# Altium schematic sheet Inductance_amplification.SchDoc
size A
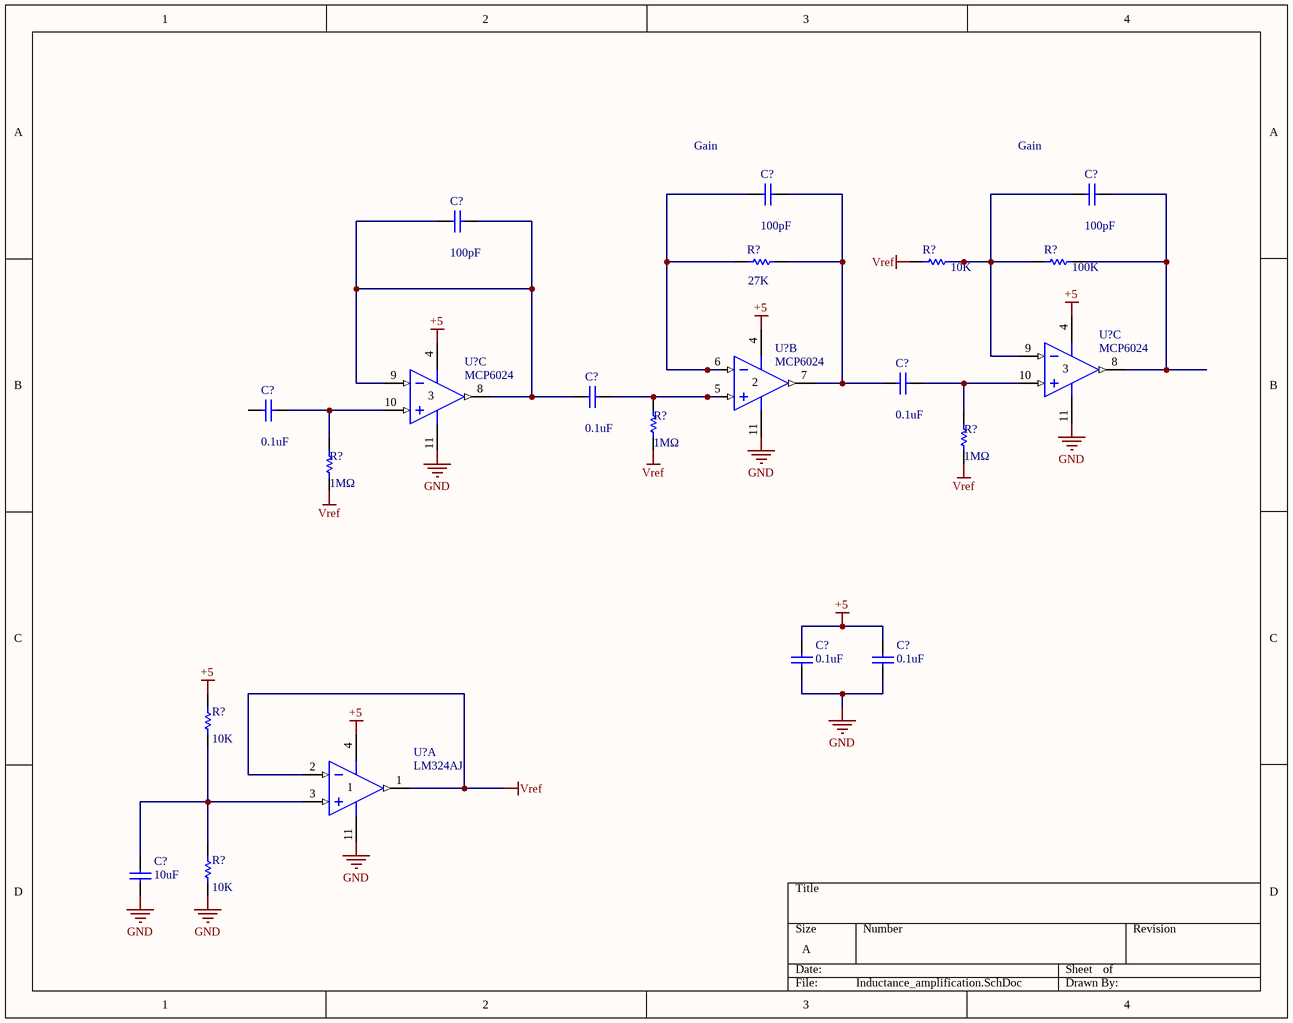
[diagram p0: Inductance_amplification.SchDoc]

## Parts
(Parts that share a designator on the sheet are numbered #1, #2 ... from top to bottom, then left to right.)
C?#1  value 100pF  [RAD-0.3]  (hidden comment: Cap)
C?#2  value 100pF  [RAD-0.3]  (hidden comment: Cap)
C?#3  value 100pF  [RAD-0.3]  (hidden comment: Cap)
C?#4  value 0.1uF  [RAD-0.3]  (hidden comment: Cap)
C?#5  value 0.1uF  [RAD-0.3]  (hidden comment: Cap)
C?#6  value 0.1uF  [RAD-0.3]  (hidden comment: Cap)
C?#7  value 0.1uF  [RAD-0.3]  (hidden comment: Cap)
C?#8  value 0.1uF  [RAD-0.3]  (hidden comment: Cap)
C?#9  value 10uF  [RAD-0.3]  (hidden comment: Cap)
R?#1  value 27K  [AXIAL-0.3]  (hidden comment: Res1)
R?#2  value 10K  [AXIAL-0.3]  (hidden comment: Res1)
R?#3  value 100K  [AXIAL-0.3]  (hidden comment: Res1)
R?#4  value 1MΩ  [AXIAL-0.3]  (hidden comment: Res1)
R?#5  value 1MΩ  [AXIAL-0.3]  (hidden comment: Res1)
R?#6  value 1MΩ  [AXIAL-0.3]  (hidden comment: Res1)
R?#7  value 10K  [AXIAL-0.3]  (hidden comment: Res1)
R?#8  value 10K  [AXIAL-0.3]  (hidden comment: Res1)
U?#1  MCP6024  [DIP-14/D19.7]  (part C of 4)
U?#2  MCP6024  [DIP-14/D19.7]  (part B of 4)
U?#3  MCP6024  [DIP-14/D19.7]  (part C of 4)
U?#4  LM324AJ  [DIP-14]  (part A of 4)

## Nets
+5: C?#7.2 C?#8.2 R?#7.2 U?#1.4(V+) U?#2.4(V+) U?#3.4(V+) U?#4.4(V+)
GND: C?#7.1 C?#8.1 C?#9.1 R?#8.1 U?#1.11(V-) U?#2.11(V-) U?#3.11(V-) U?#4.11(GND)
Vref: R?#2.1 R?#4.1 R?#5.1 R?#6.1 U?#4.1(OUT) U?#4.2(IN-)
NetC?#1_1: C?#1.1 R?#1.1 U?#2.6(IN-)
NetC?#1_2: C?#1.2 C?#4.1 R?#1.2 U?#2.7(OUT)
NetC?#2_1: C?#2.1 R?#2.2 R?#3.1 U?#1.9(IN-)
NetC?#2_2: C?#2.2 R?#3.2 U?#1.8(OUT)
NetC?#3_1: C?#3.1 C?#3.2 C?#5.1 U?#3.8(OUT) U?#3.9(IN-)
NetC?#4_2: C?#4.2 R?#5.2 U?#1.10(IN+)
NetC?#5_2: C?#5.2 R?#4.2 U?#2.5(IN+)
NetC?#6_2: C?#6.2 R?#6.2 U?#3.10(IN+)
NetC?#9_2: C?#9.2 R?#7.1 R?#8.2 U?#4.3(IN+)

Not connected (* = marked no-connect by the designer): C?#6 1

## Notes on the sheet
- Gain

## Library data of the parts
C?#1-C?#3 C?#7-C?#9 = Cap: Capacitor; Manufacturer: Generic Components; Class: Passive; Published: 08/06/2000; Publisher: Altium Hobart Technology Centre; SubClass: Capacitor
C?#4-C?#6 = Cap: Capacitor; Published: 8-Jun-2000; LatestRevisionDate: 17-Jul-2002; LatestRevisionNote: Re-released for DXP Platform.; PackageReference: RAD-0.3; Publisher: Altium Limited; PackageDescription: Radial Cap, Thru-Hole; 2 Leads; 0.3 in Pin Spacing
R?#1-R?#8 = Res1: Resistor; Manufacturer: Generic Components; Class: Passive; Published: 08/06/2000; Publisher: Altium Hobart Technology Centre; SubClass: Resistor
U?#1-U?#3 = MCP6024: Quad Low-Power Low Offset 10MHz Rail-to-Rail I/O Operational Amplifier; Manufacturer: National Semiconductor; Published: 15/04/2002; Publisher: Altium Hobart Technology Centre; Class: Amplifier; SubClass: Operational Amplifier
U?#4 = LM324AJ: Low-Power Quad Operational Amplifier; Manufacturer: National Semiconductor; Published: 15/04/2002; Publisher: Altium Hobart Technology Centre; Class: Amplifier; SubClass: Operational Amplifier